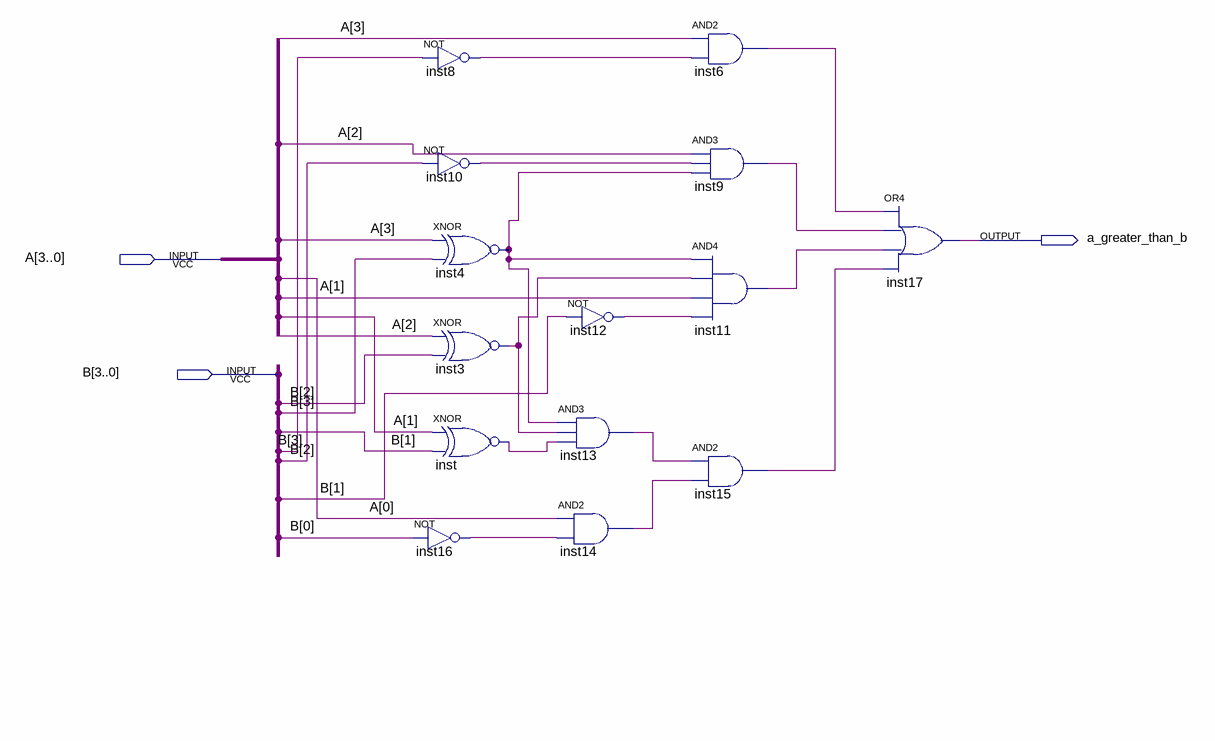
[diagram p0: schematic sheet]
// Quartus schematic AgreaterthanB.bdf as structural Verilog: 14 symbols, 3 pins
module AgreaterthanB (
  input  [3:0] A,
  input  [3:0] B,
  output a_greater_than_b
);

  wire inst3_out, inst4_out, inst6_out, inst8_out, inst9_out, inst10_out, inst11_out, inst12_out, inst13_out,
       inst14_out, inst15_out, inst16_out, inst_out;

  not inst8 (inst8_out, B[3]);
  not inst10 (inst10_out, B[2]);
  xnor inst4 (inst4_out, A[3], B[3]);
  xnor inst3 (inst3_out, A[2], B[2]);
  xnor inst (inst_out, A[1], B[1]);
  not inst16 (inst16_out, B[0]);
  not inst12 (inst12_out, B[1]);
  and inst13 (inst13_out, inst4_out, inst3_out, inst_out);
  and inst14 (inst14_out, A[0], inst16_out);
  and inst6 (inst6_out, A[3], inst8_out);
  and inst9 (inst9_out, A[2], inst10_out, inst4_out);
  and inst11 (inst11_out, inst4_out, inst3_out, A[1], inst12_out);
  and inst15 (inst15_out, inst13_out, inst14_out);
  or inst17 (a_greater_than_b, inst6_out, inst9_out, inst11_out, inst15_out);
endmodule
